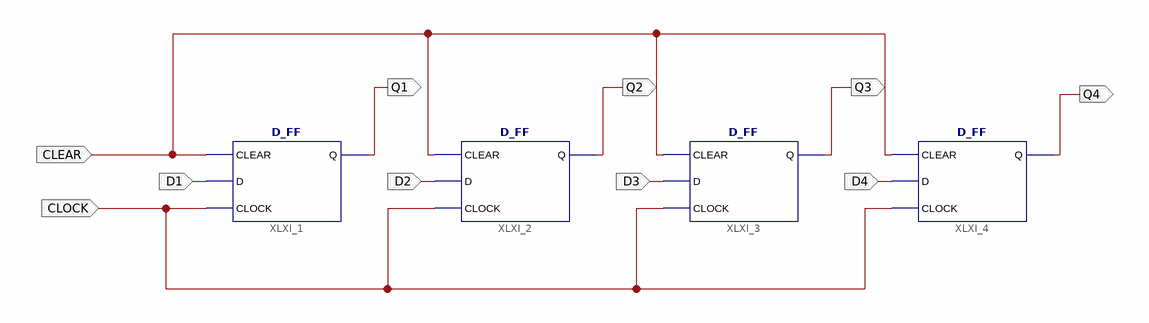
[diagram p0: schematic sheet 1]
// Xilinx ISE schematic PIPO.sch (artix7) as structural Verilog: 4 symbols, 10 ports
module PIPO (
  input  CLOCK,
  input  CLEAR,
  input  D1,
  input  D2,
  input  D3,
  input  D4,
  output Q1,
  output Q2,
  output Q3,
  output Q4
);

  D_FF XLXI_1 (.CLEAR(CLEAR), .CLOCK(CLOCK), .D(D1), .Q(Q1));
  D_FF XLXI_2 (.CLEAR(CLEAR), .CLOCK(CLOCK), .D(D2), .Q(Q2));
  D_FF XLXI_3 (.CLEAR(CLEAR), .CLOCK(CLOCK), .D(D3), .Q(Q3));
  D_FF XLXI_4 (.CLEAR(CLEAR), .CLOCK(CLOCK), .D(D4), .Q(Q4));
endmodule
